# Altium schematic sheet AudioSubsystem.SchDoc: Audio Subsystem
size Letter; DocumentNumber: 4; Revision: 1; SheetNumber: 4; SheetTotal: 6
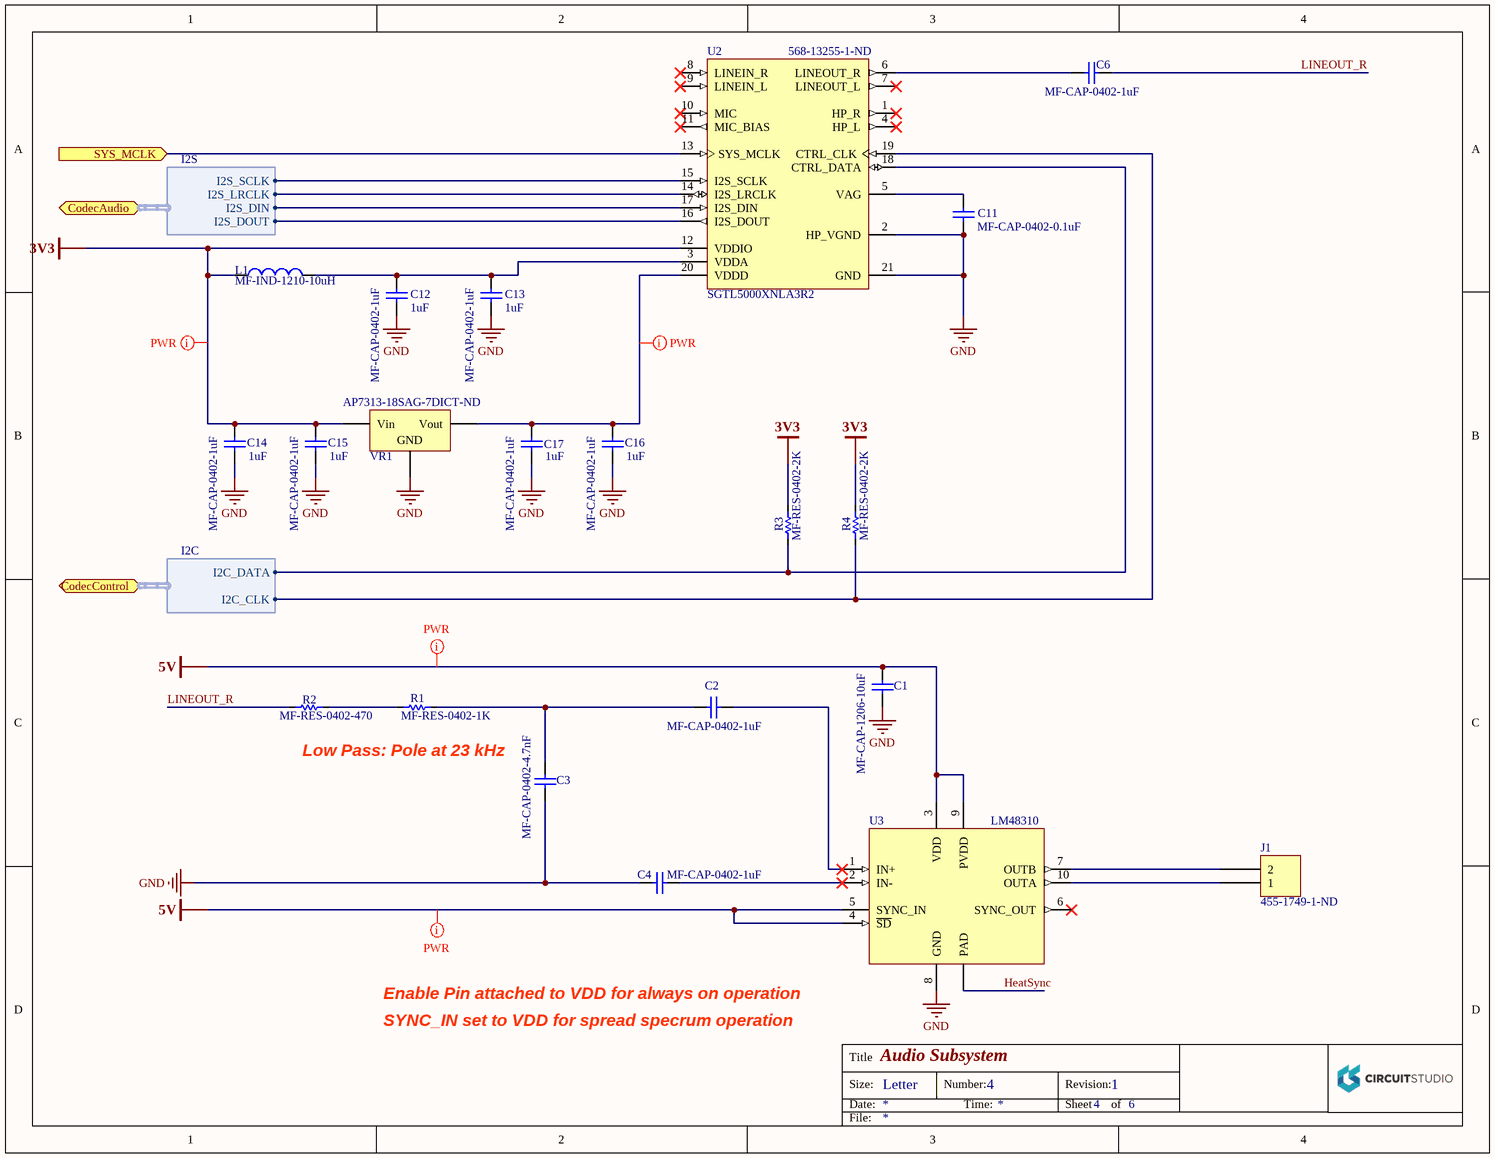
[diagram p0: AudioSubsystem.SchDoc]

## Parts
C1  MF-CAP-1206-10uF  [C1206L]
C2  MF-CAP-0402-1uF  [C0402N]
C3  MF-CAP-0402-4.7nF  [C0402L]
C4  MF-CAP-0402-1uF  [C0402N]
C6  MF-CAP-0402-1uF  [C0402N]
C11  MF-CAP-0402-0.1uF  [C0402N]
C12  MF-CAP-0402-1uF  Capacitance: 1uF  [C0402N]
C13  MF-CAP-0402-1uF  Capacitance: 1uF  [C0402N]
C14  MF-CAP-0402-1uF  Capacitance: 1uF  [C0402N]
C15  MF-CAP-0402-1uF  Capacitance: 1uF  [C0402N]
C16  MF-CAP-0402-1uF  Capacitance: 1uF  [C0402N]
C17  MF-CAP-0402-1uF  Capacitance: 1uF  [C0402N]
J1  455-1749-1-ND  [JST S2B-PH-SM4]
L1  MF-IND-1210-10uH  [L1210_N]
R1  MF-RES-0402-1K  [R0402L]
R2  MF-RES-0402-470  [R0402L]
R3  MF-RES-0402-2K  [R0402L]
R4  MF-RES-0402-2K  [R0402L]
U2  SGTL5000XNLA3R2  Supplier Part Number 1: 568-13255-1-ND  [FRES-2032-01_L]
U3  LM48310  [LM48310_l]
VR1  AP7313-18SAG-7DICT-ND  [AP7313_L]

## Ports
CodecAudio (harness I2S), CodecControl (harness I2C), SYS_MCLK (in)

## Harnesses
I2S: I2S_SCLK, I2S_LRCLK, I2S_DIN, I2S_DOUT
I2C: I2C_CLK, I2C_DATA

## Nets
3V3: C14.1 C15.1 L1.1 R3.2 R4.2 U2.12(VDDIO) VR1.1(Vin)
5V: C1.1 U3.3(VDD) U3.4(~{SD}) U3.5(SYNC_IN) U3.9(PVDD)
GND: C1.2 C3.1 C4.2 C11.2 C12.2 C13.2 C14.2 C15.2 C16.2 C17.2 U2.2(HP_VGND) U2.21(GND) U3.8(GND) VR1.3(GND)
HeatSync: U3.11(PAD)
LINEOUT_R: C6.1 R2.1
SYS_MCLK: U2.13(SYS_MCLK) ; port SYS_MCLK
NetC2_1: C2.1 U3.1(IN+)
NetC2_2: C2.2 C3.2 R1.2
NetC4_1: C4.1 U3.2(IN-)
NetC6_2: C6.2 U2.6(LINEOUT_R)
NetC11_1: C11.1 U2.5(VAG)
NetC12_1: C12.1 C13.1 L1.2 U2.3(VDDA)
NetC16_1: C16.1 C17.1 U2.20(VDDD) VR1.2(Vout)
NetJ1_1: J1.1 U3.10(OUTA)
NetJ1_2: J1.2 U3.7(OUTB)
NetR1_1: R1.1 R2.2
NetR3_1: R3.1 U2.18(CTRL_DATA) ; port CodecControl.I2C_DATA
NetR4_1: R4.1 U2.19(CTRL_CLK) ; port CodecControl.I2C_CLK
NetU2_14: U2.14(I2S_LRCLK) ; port CodecAudio.I2S_LRCLK
NetU2_15: U2.15(I2S_SCLK) ; port CodecAudio.I2S_SCLK
NetU2_16: U2.16(I2S_DOUT) ; port CodecAudio.I2S_DOUT
NetU2_17: U2.17(I2S_DIN) ; port CodecAudio.I2S_DIN

Not connected (* = marked no-connect by the designer): U2 1(HP_R)* 4(HP_L)* 7(LINEOUT_L)* 8(LINEIN_R)* 9(LINEIN_L)* 10(MIC)* 11(MIC_BIAS)*; U3 6(SYNC_OUT)*

## Layout directives
net class PWR: 3V3, 5V, NetC16_1

## Notes on the sheet
- Low Pass: Pole at 23 kHz
- Enable Pin attached to VDD for always on operation
- SYNC_IN set to VDD for spread specrum operation
- Title
- Size:
- Date:
- Letter
- Number:
- Time:
- Revision:
- Sheet
- of
- File:

## Library data of the parts
C1 = CAPACITOR_NP: HOUSEPART: YES; POPULATE: 1; TOLERANCE: 10%; VOLTAGE: 16V; VALUE: 10uF; LibraryName: MF_Passives; DeviceSetName: CAPACITOR_NP; MF_PARTNUM: MF-CAP-1206-10uF; Supplier 1: Digi-Key; Supplier Part Number 1: 445-1426-1-ND
C2 C4 C6 = CAPACITOR_NP: HOUSEPART: YES; POPULATE: 1; TOLERANCE: 10%; VOLTAGE: 16V; Capacitance: 1uF; LibraryName: MF_Passives; DeviceSetName: CAPACITOR_NP; MF_PARTNUM: MF-CAP-0402-1uF; Supplier 1: Digi-Key; Supplier Part Number 1: 490-10453-1-ND
C3 = CAPACITOR_NP: HOUSEPART: YES; POPULATE: 1; VALUE: 4.7nF; LibraryName: MF_Passives; DeviceSetName: CAPACITOR_NP; MF_PARTNUM: MF-CAP-0402-4.7nF; Supplier 1: Digi-Key; Supplier Part Number 1: 490-6313-1-ND
C11 = CAPACITOR_NP: HOUSEPART: YES; POPULATE: 1; TOLERANCE: 10%; VOLTAGE: 16V; Capacitance: 100nF; LibraryName: MF_Passives; DeviceSetName: CAPACITOR_NP; MF_PARTNUM: MF-CAP-0402-0.1uF; Supplier 1: Digi-Key; Supplier Part Number 1: 490-5415-1-ND
C12-C17 = CAPACITOR_NP: HOUSEPART: YES; POPULATE: 1; LibraryName: MF_Passives; DeviceSetName: CAPACITOR_NP; MF_PARTNUM: MF-CAP-0402-1uF; Supplier 1: Digi-Key; Supplier Part Number 1: 490-10453-1-ND
J1 = 2 Pin: HOUSEPART: NO; Supplier 1: Digi-Key; Supplier Part Number 1: 455-1749-1-ND
L1 = INDUCTOR: HOUSEPART: YES; POPULATE: 1; LibraryName: MF_Passives; DeviceSetName: INDUCTOR; MF_PARTNUM: MF-IND-1210-10uH; Supplier 1: Digi-Key; Supplier Part Number 1: 732-4670-1-ND
R1 = RESISTOR: HOUSEPART: YES; POPULATE: 1; VOLTAGE: 50 V; WATTAGE: 100mW; VALUE: 1K; SymbolName_1: RESISTOR; LibraryName: MF_Passives; DeviceSetName: RESISTOR; MF_PARTNUM: MF-RES-0402-1K; Supplier 1: Digi-Key; Supplier Part Number 1: P1.0KJCT-ND
R2 = RESISTOR: HOUSEPART: YES; POPULATE: 1; TOLERANCE: 5%; VOLTAGE: 50V; WATTAGE: 100mW; SymbolName_1: RESISTOR; LibraryName: MF_Passives; DeviceSetName: RESISTOR; MF_PARTNUM: MF-RES-0402-470; Supplier 1: Digi-Key; Supplier Part Number 1: P470JCT-ND
R3 R4 = RESISTOR: =MF_PARTNUM; HOUSEPART: YES; POPULATE: 1; VOLTAGE: 50 V; WATTAGE: 100mW; VALUE: 1K; SymbolName_1: RESISTOR; LibraryName: MF_Passives; DeviceSetName: RESISTOR; MF_PARTNUM: MF-RES-0402-2K; Supplier 1: Digi-Key; Supplier Part Number 1: P1.0KJCT-ND
U2 = CMP-1078-00004-1: Low Power Stereo Codec with Headphone Amp, 1.1 to 2 V, -40 to 85 degC, 20-Pin QFN-EP, RoHS, Tape and Reel; Manufacturer: Freescale Semiconductor; HOUSEPART: NO; SYS_MCLK Rise/Fall Time: 0.5 to 10 ns; VDDD(V): 1.1 to 2; LINEOUT Output Impedance: 320 Ohm Typ.; VDDIO(V): 1.62 to 3.6; MIC Input Impedance: 2.9 KOhm Typ.; ComponentLink1Description: Manufacturer URL; ComponentLink2Description: Datasheet; Temperature Range: -40 to 85 degC; PartNumber: SGTL5000XNLA3R2; ComponentLink2URL: http://cache.freescale.com/files/analog/doc/data_sheet/SGTL5000.pdf?pspll=1&Parent_nodeId=1227651963351723867067&Parent_pageType=product; RoHS: TRUE; ComponentLink3URL: http://cache.freescale.com/files/shared/doc/package_info/98ARE10742D.pdf?&Parent_nodeId=&Parent_pageType=; ComponentLink1URL: http://www.freescale.com/; Mounting Technology: Surface Mount; ComponentLink3Description: Package Specification; PackageDescription: 20-Pin Thermally Enhanced Quad Flat Non-Lead Package(QFN), Body 3 x 3 mm, Pitch 0.4 mm; Packing: Tape and Reel; DatasheetVersion: Rev. 6.0; PackageVersion: Rev. O; PackageReference: 2032-01; Supplier 1: Digi-Key
VR1 = Volt Reg: Voltage Regulator; HOUSEPART: NO; Input Voltage: 2V to 6V; Output Voltage: 1V to 3.3V Fixed; Startup Time: 80uS; Current - Output: 150mA; Dropout Voltage: 150mV; Current - Quiescent (Iq): 75µA; PSRR: 65dB (100Hz); Protection Features: Over Current, Over Temperature, Short Circuit; PackageDescription: 3-Pin Transistor Outline Package 2.54 mm Pitch, 15.1 mm Lead Span; Package: SOT23; Operating Temperature: -40°C ~ 85°C; Supplier 1: Digi-Key; Supplier Part Number 1: AP7313-18SAG-7DICT-ND